# Altium schematic sheet A3.SchDoc
size A3; SheetNumber: ?; SheetTotal: ?
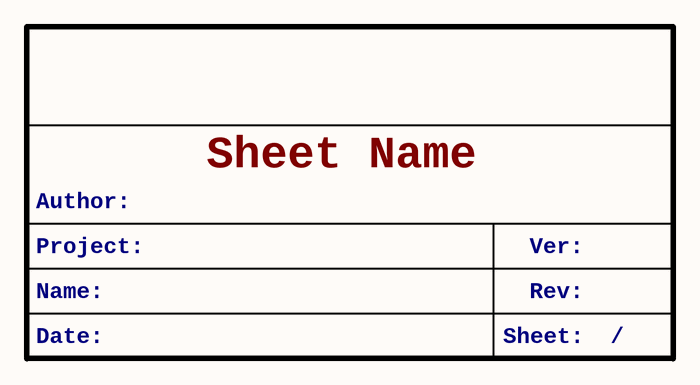
[diagram p0: A3.SchDoc]

## Notes on the sheet
- Author:
- Project:
- Sheet Name
- Ver:
- Name:
- Date:
- Sheet:
- Rev:
- /